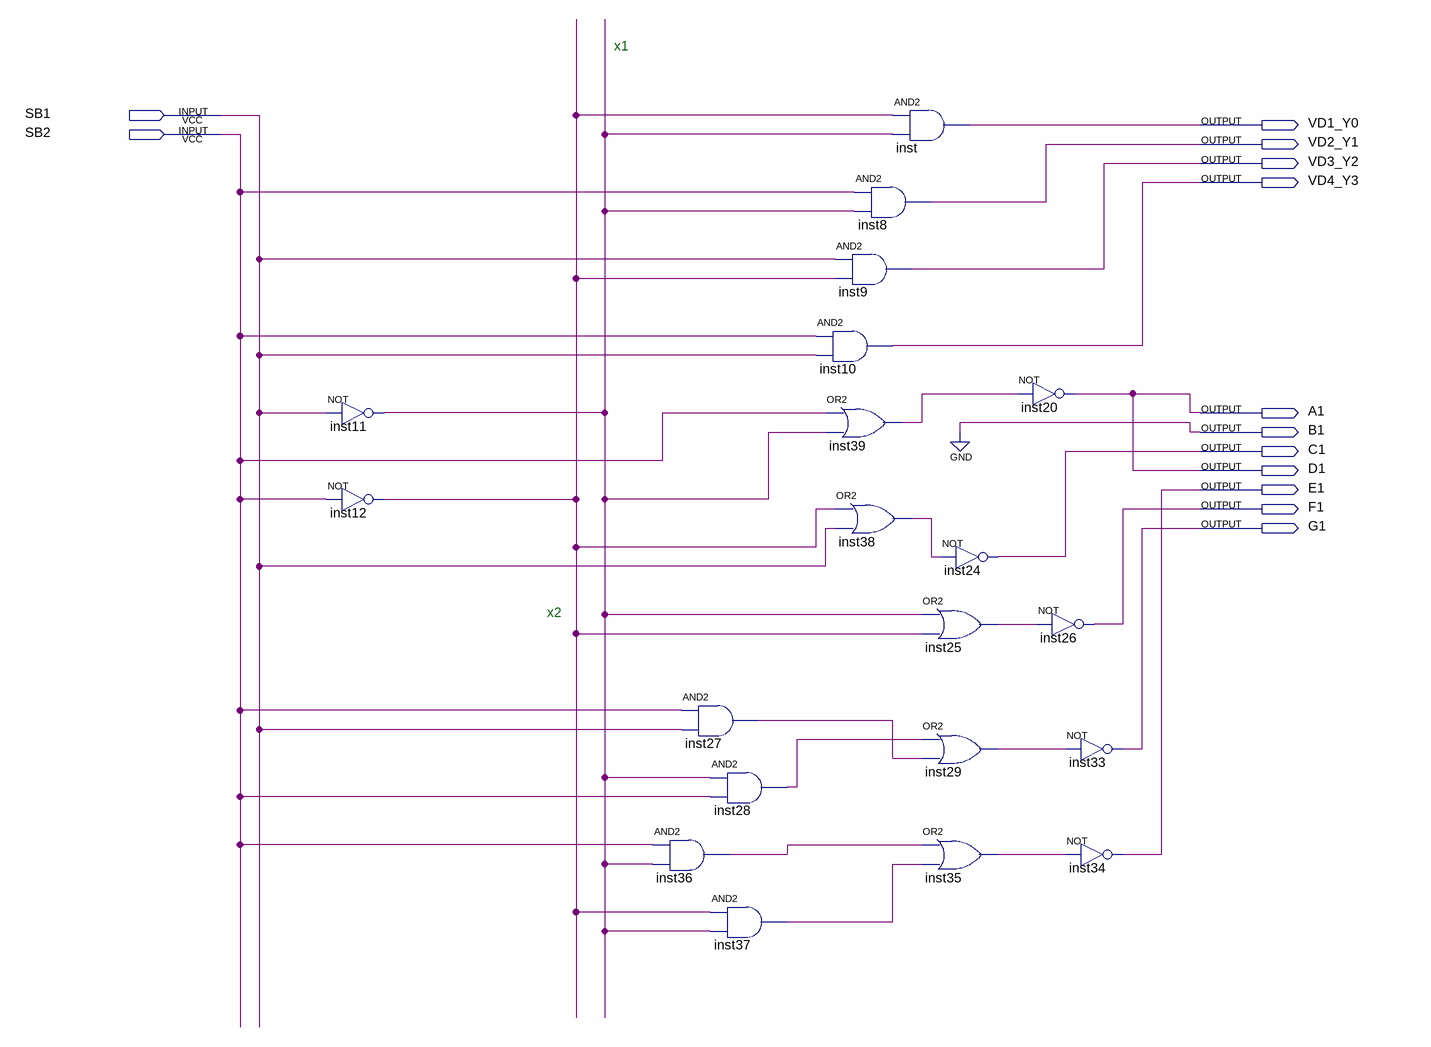
[diagram p0: schematic sheet]
// Quartus schematic Block3.bdf as structural Verilog: 20 symbols, 13 pins
module Block3 (
  input  SB1,
  input  SB2,
  output VD1_Y0,
  output VD2_Y1,
  output VD3_Y2,
  output VD4_Y3,
  output A1,
  output B1,
  output C1,
  output D1,
  output E1,
  output F1,
  output G1
);

  wire inst11_out, inst12_out, inst25_out, inst27_out, inst28_out, inst29_out, inst35_out, inst36_out,
       inst37_out, inst38_out, inst39_out;

  not inst11 (inst11_out, SB1);
  not inst12 (inst12_out, SB2);
  and inst36 (inst36_out, SB2, inst11_out);
  and inst27 (inst27_out, SB2, SB1);
  and inst28 (inst28_out, inst11_out, SB2);
  and inst37 (inst37_out, inst12_out, inst11_out);
  and inst10 (VD4_Y3, SB2, SB1);
  or inst39 (inst39_out, SB2, inst11_out);
  and inst (VD1_Y0, inst12_out, inst11_out);
  and inst8 (VD2_Y1, SB2, inst11_out);
  and inst9 (VD3_Y2, SB1, inst12_out);
  or inst38 (inst38_out, inst12_out, SB1);
  not inst24 (C1, inst38_out);
  or inst25 (inst25_out, inst11_out, inst12_out);
  or inst29 (inst29_out, inst28_out, inst27_out);
  or inst35 (inst35_out, inst36_out, inst37_out);
  not inst20 (A1, inst39_out);
  not inst26 (F1, inst25_out);
  not inst33 (G1, inst29_out);
  not inst34 (E1, inst35_out);

  assign B1 = 1'b0;
  assign D1 = A1;

  // Notes on the sheet:
  //   x1
  //   x2
endmodule
